# Altium schematic sheet PowerSupplies.SchDoc: Switching Power Supplies
size 594 x 420 mm; CheckedBy: T.Janicki; Author: Grzegorz Kasprowicz; CompanyName: Creotech Instruments SA; DrawnBy: G.Kasprowicz; Organization: CERN; Address1: European Organization for Nuclear Research; Address2: CH-1211 Genève 23 - Switzerland; Revision: -; SheetNumber: 4; SheetTotal: 11; EDA_Number: EDA-xxxx; Projet: Simple VME FMC Carrier; ModifiedBy: -; CreateDate: 20/11/2012; CheckedDate: 23/01/2012; DivGrp: BE-CO; Designer: G.Kasprowicz; PageSetup: Record=PageOptions|CenterHorizontal=True|CenterVertical=True|PrintScale=0.68|XCorrection=1.00|YCorrection=1.00|PrintKind=1|BorderSize=5000000|LeftOffset=0|BottomOffset=0|Orientation=2|PaperLength=1000|PaperWidth=1000|Scale=100|PaperSource=15|PrintQuality=600|MediaType=1|DitherType=10|PaperKind=A3|PrintScaleMode=1; ModifiedDate: -
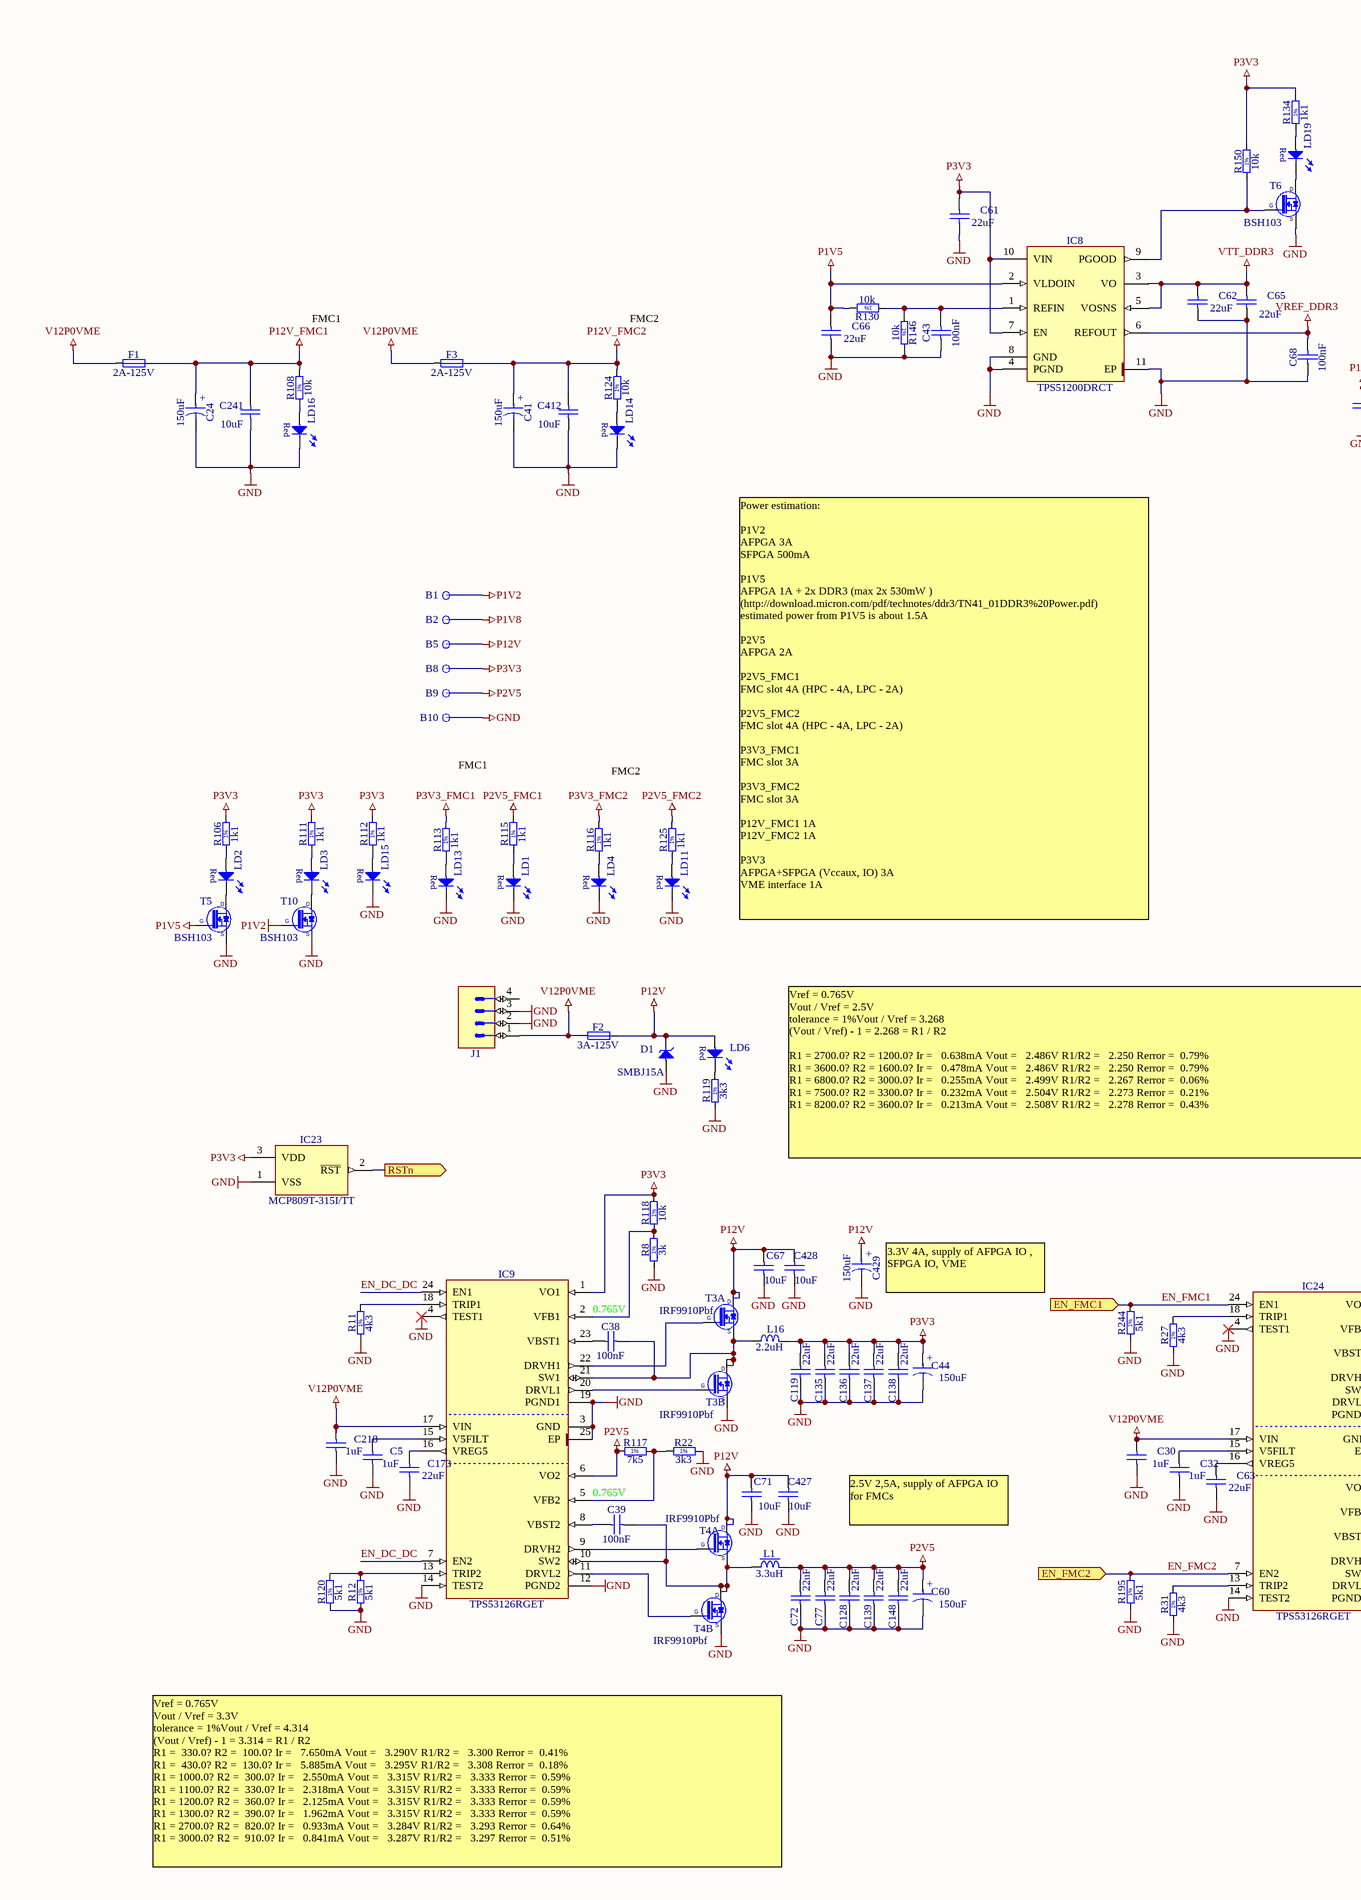
[diagram p0: PowerSupplies.SchDoc, left]
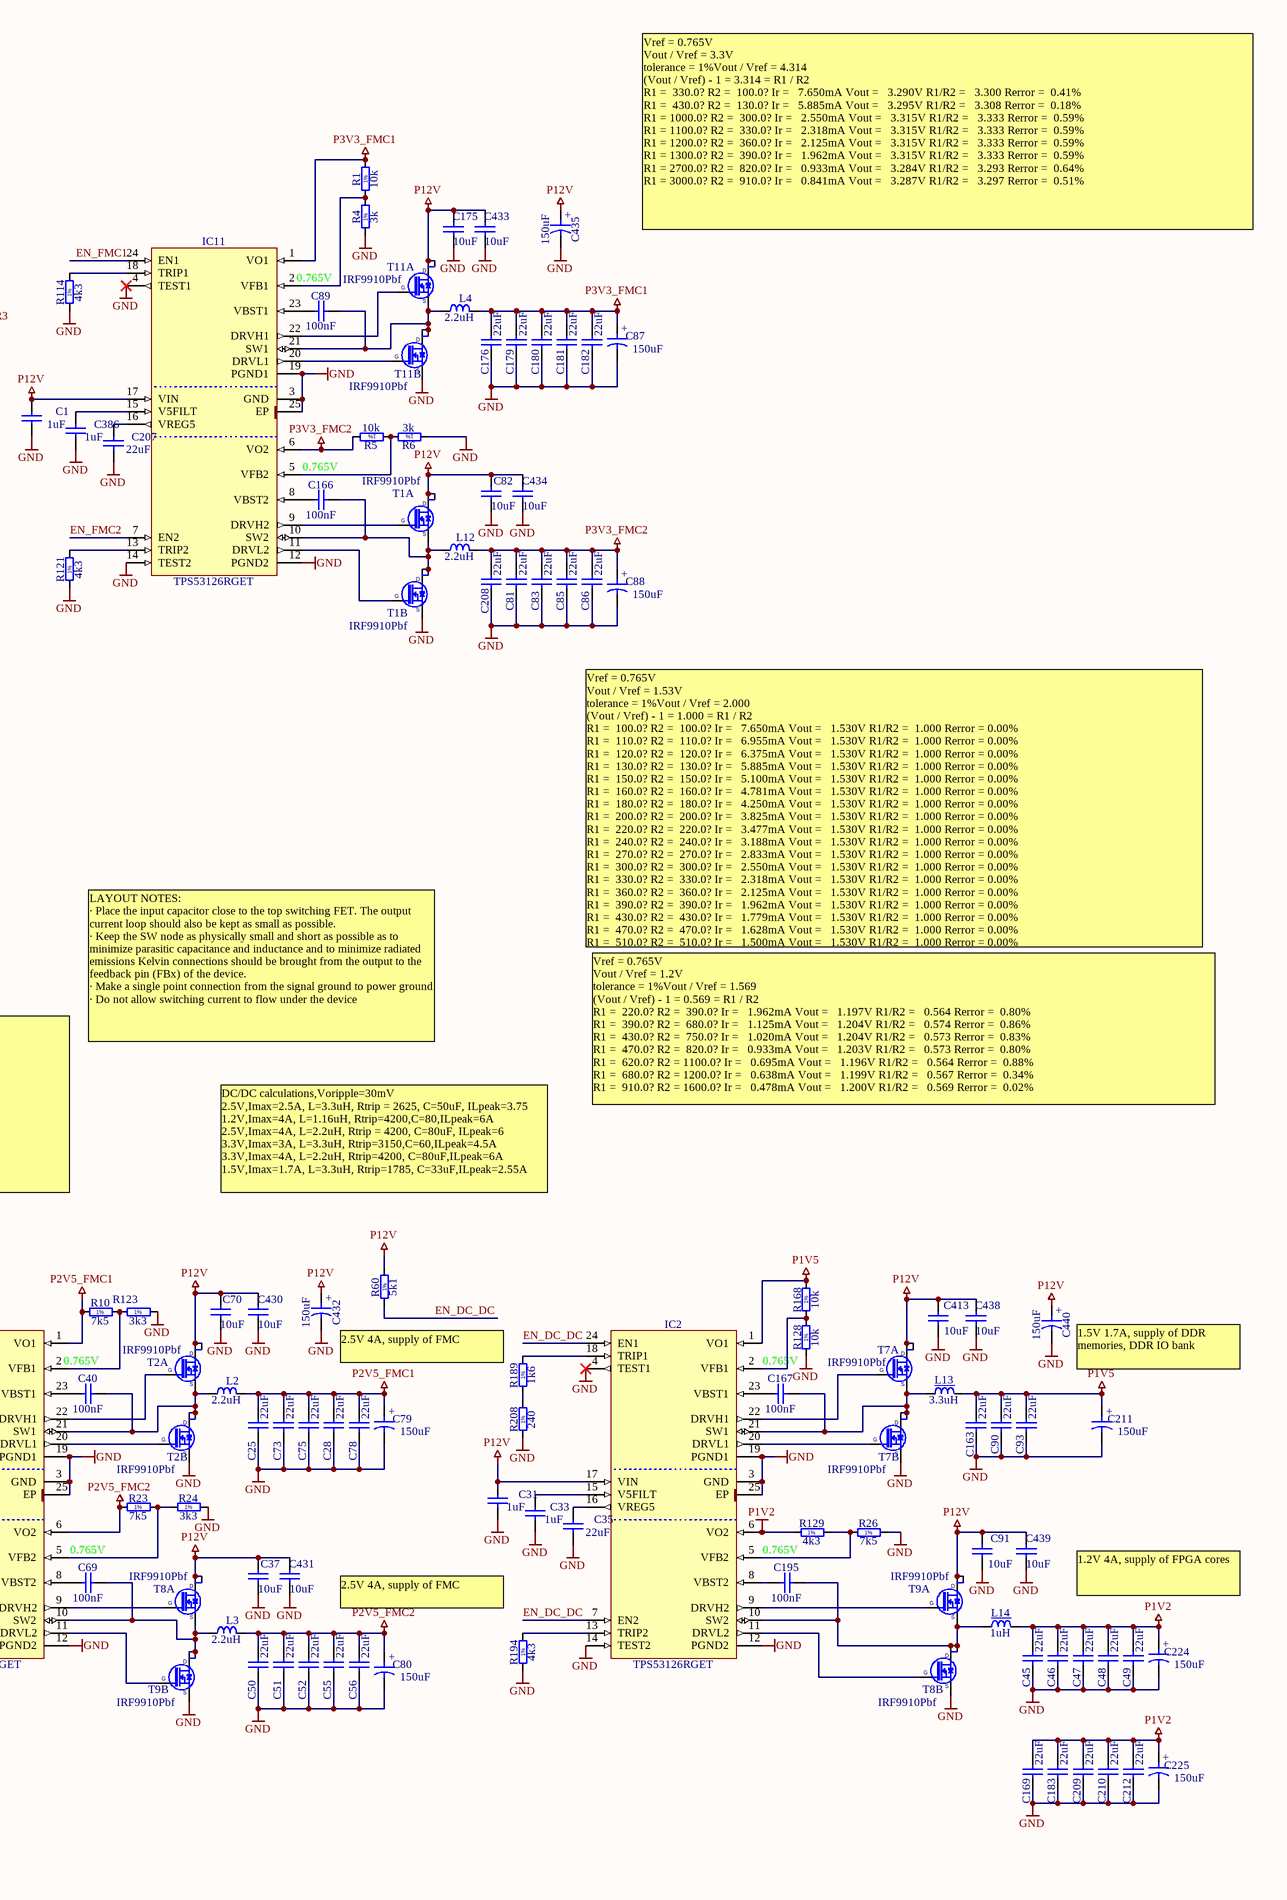
[diagram p1: PowerSupplies.SchDoc, right]

## Parts
B1  Plated Hole  [c130h80]  (value not drawn)
B2  Plated Hole  [c130h80]  (value not drawn)
B5  Plated Hole  [c130h80]  (value not drawn)
B8  Plated Hole  [c130h80]  (value not drawn)
B9  Plated Hole  [c130h80]  (value not drawn)
B10  Plated Hole  [c130h80]  (value not drawn)
C1  1uF  [CAPC1608X87N]
C5  1uF  [CAPC1608X87N]
C24  150uF  [CAPPR350-850X700]
C25  22uF  [CAPC3216X180N]
C28  22uF  [CAPC3216X180N]
C30  1uF  [CAPC1608X87N]
C31  1uF  [CAPC1608X87N]
C32  1uF  [CAPC1608X87N]
C33  1uF  [CAPC1608X87N]
C35  22uF  [CAPC3216X180N]
C37  10uF  [CAPC3225X270N]
C38  100nF  [CAPC1005X55N]
C39  100nF  [CAPC1005X55N]
C40  100nF  [CAPC1005X55N]
C41  150uF  [CAPPR350-850X700]
C43  100nF  [CAPC1005X55N]
C44  150uF  [CAPPR350-850X700]
C45  22uF  [CAPC3216X180N]
C46  22uF  [CAPC3216X180N]
C47  22uF  [CAPC3216X180N]
C48  22uF  [CAPC3216X180N]
C49  22uF  [CAPC3216X180N]
C50  22uF  [CAPC3216X180N]
C51  22uF  [CAPC3216X180N]
C52  22uF  [CAPC3216X180N]
C55  22uF  [CAPC3216X180N]
C56  22uF  [CAPC3216X180N]
C60  150uF  [CAPPR350-850X700]
C61  22uF  [CAPC3216X180N]
C62  22uF  [CAPC3216X180N]
C63  22uF  [CAPC3216X180N]
C65  22uF  [CAPC3216X180N]
C66  22uF  [CAPC3216X180N]
C67  10uF  [CAPC3225X270N]
C68  100nF  [CAPC1005X55N]
C69  100nF  [CAPC1005X55N]
C70  10uF  [CAPC3225X270N]
C71  10uF  [CAPC3225X270N]
C72  22uF  [CAPC3216X180N]
C73  22uF  [CAPC3216X180N]
C75  22uF  [CAPC3216X180N]
C77  22uF  [CAPC3216X180N]
C78  22uF  [CAPC3216X180N]
C79  150uF  [CAPPR350-850X700]
C80  150uF  [CAPPR350-850X700]
C81  22uF  [CAPC3216X180N]
C82  10uF  [CAPC3225X270N]
C83  22uF  [CAPC3216X180N]
C85  22uF  [CAPC3216X180N]
C86  22uF  [CAPC3216X180N]
C87  150uF  [CAPPR350-850X700]
C88  150uF  [CAPPR350-850X700]
C89  100nF  [CAPC1005X55N]
C90  22uF  [CAPC3216X180N]
C91  10uF  [CAPC3225X270N]
C93  22uF  [CAPC3216X180N]
C119  22uF  [CAPC3216X180N]
C128  22uF  [CAPC3216X180N]
C135  22uF  [CAPC3216X180N]
C136  22uF  [CAPC3216X180N]
C137  22uF  [CAPC3216X180N]
C138  22uF  [CAPC3216X180N]
C139  22uF  [CAPC3216X180N]
C148  22uF  [CAPC3216X180N]
C163  22uF  [CAPC3216X180N]
C166  100nF  [CAPC1005X55N]
C167  100nF  [CAPC1005X55N]
C169  22uF  [CAPC3216X180N]
C173  22uF  [CAPC3216X180N]
C175  10uF  [CAPC3225X270N]
C176  22uF  [CAPC3216X180N]
C179  22uF  [CAPC3216X180N]
C180  22uF  [CAPC3216X180N]
C181  22uF  [CAPC3216X180N]
C182  22uF  [CAPC3216X180N]
C183  22uF  [CAPC3216X180N]
C195  100nF  [CAPC1005X55N]
C207  22uF  [CAPC3216X180N]
C208  22uF  [CAPC3216X180N]
C209  22uF  [CAPC3216X180N]
C210  22uF  [CAPC3216X180N]
C211  150uF  [CAPPR350-850X700]
C212  22uF  [CAPC3216X180N]
C218  1uF  [CAPC1608X87N]
C224  150uF  [CAPPR350-850X700]
C225  150uF  [CAPPR350-850X700]
C241  10uF  [CAPC3225X270N]
C386  1uF  [CAPC1608X87N]
C412  10uF  [CAPC3225X270N]
C413  10uF  [CAPC3225X270N]
C427  10uF  [CAPC3225X270N]
C428  10uF  [CAPC3225X270N]
C429  150uF  [CAPPR500-1050X800]
C430  10uF  [CAPC3225X270N]
C431  10uF  [CAPC3225X270N]
C432  150uF  [CAPPR500-1050X800]
C433  10uF  [CAPC3225X270N]
C434  10uF  [CAPC3225X270N]
C435  150uF  [CAPPR500-1050X800]
C438  10uF  [CAPC3225X270N]
C439  10uF  [CAPC3225X270N]
C440  150uF  [CAPPR500-1050X800]
D1  SMBJ15A  [DIOM5336X265N]
F1  2A-125V  [FUSE_LITTELFUSE_0154]
F2  3A-125V  [FUSE_LITTELFUSE_0154]
F3  2A-125V  [FUSE_LITTELFUSE_0154]
IC2  TPS53126RGET  [QFN50P400X400X100-25N-S255]
IC8  TPS51200DRCT  [SON50P300X300X100-11N-R175X250]
IC9  TPS53126RGET  [QFN50P400X400X100-25N-S255]
IC11  TPS53126RGET  [QFN50P400X400X100-25N-S255]
IC23  MCP809T-315I/TT  [SOT95P237X112-3N]
IC24  TPS53126RGET  [QFN50P400X400X100-25N-S255]
J1  Header 4  [TYCO_350211-1]  (value not drawn)
L1  3.3uH  [IND_COILCRAFT_DO3316]
L2  2.2uH  [IND_BOURNS_SRR1260]
L3  2.2uH  [IND_BOURNS_SRR1260]
L4  2.2uH  [IND_BOURNS_SRR1260]
L12  2.2uH  [IND_BOURNS_SRR1260]
L13  3.3uH  [IND_COILCRAFT_DO3316]
L14  1uH  [IND_COILCRAFT_DO3316]
L16  2.2uH  [IND_BOURNS_SRR1260]
LD1  Red  [LEDC1608X80N_RED]  (value not drawn)
LD2  Red  [LEDC1608X80N_RED]  (value not drawn)
LD3  Red  [LEDC1608X80N_RED]  (value not drawn)
LD4  Red  [LEDC1608X80N_RED]  (value not drawn)
LD6  Red  [LEDC1608X80N_RED]  (value not drawn)
LD11  Red  [LEDC1608X80N_RED]  (value not drawn)
LD13  Red  [LEDC1608X80N_RED]  (value not drawn)
LD14  Red  [LEDC1608X80N_RED]  (value not drawn)
LD15  Red  [LEDC1608X80N_RED]  (value not drawn)
LD16  Red  [LEDC1608X80N_RED]  (value not drawn)
LD19  Red  [LEDC1608X80N_RED]  (value not drawn)
R1  10k  [RESC1608X55N]
R4  3k  [RESC1608X55N]
R5  10k  [RESC1608X55N]
R6  3k  [RESC1608X55N]
R8  3k  [RESC1608X55N]
R10  7k5  [RESC1608X55N]
R11  4k3  [RESC1608X55N]
R12  5k1  [RESC1608X55N]
R22  3k3  [RESC1608X55N]
R23  7k5  [RESC1608X55N]
R24  3k3  [RESC1608X55N]
R26  7k5  [RESC1608X55N]
R27  4k3  [RESC1608X55N]
R31  4k3  [RESC1608X55N]
R60  5k1  [RESC1608X55N]
R106  1k1  [RESC1608X55N]
R108  10k  [RESC1608X55N]
R111  1k1  [RESC1608X55N]
R112  1k1  [RESC1608X55N]
R113  1k1  [RESC1608X55N]
R114  4k3  [RESC1608X55N]
R115  1k1  [RESC1608X55N]
R116  1k1  [RESC1608X55N]
R117  7k5  [RESC1608X55N]
R118  10k  [RESC1608X55N]
R119  3k3  [RESC1608X55N]
R120  5k1  [RESC1608X55N]
R121  4k3  [RESC1608X55N]
R123  3k3  [RESC1608X55N]
R124  10k  [RESC1608X55N]
R125  1k1  [RESC1608X55N]
R128  10k  [RESC1608X55N]
R129  4k3  [RESC1608X55N]
R130  10k  [RESC1608X55N]
R134  1k1  [RESC1608X55N]
R146  10k  [RESC1608X55N]
R150  10k  [RESC1608X55N]
R168  10k  [RESC1608X55N]
R189  1k6  [RESC1608X55N]
R194  4k3  [RESC1608X55N]
R195  5k1  [RESC1608X55N]
R208  240  [RESC1608X55N]
R244  5k1  [RESC1608X55N]
T1  IRF9910Pbf  [SOIC127P600X175-8N]  (parts A,B of 2)
T2  IRF9910Pbf  [SOIC127P600X175-8N]  (parts A,B of 2)
T3  IRF9910Pbf  [SOIC127P600X175-8N]  (parts A,B of 2)
T4  IRF9910Pbf  [SOIC127P600X175-8N]  (parts A,B of 2)
T5  BSH103  [SOT95P230X110-3N]
T6  BSH103  [SOT95P230X110-3N]
T7  IRF9910Pbf  [SOIC127P600X175-8N]  (parts A,B of 2)
T8  IRF9910Pbf  [SOIC127P600X175-8N]  (parts A,B of 2)
T9  IRF9910Pbf  [SOIC127P600X175-8N]  (parts A,B of 2)
T10  BSH103  [SOT95P230X110-3N]
T11  IRF9910Pbf  [SOIC127P600X175-8N]  (parts A,B of 2)

## Ports
EN_FMC1 (in), EN_FMC2 (in), RSTn (out)

## Nets
GND: B10.1 C1.2 C5.1 C24.2 C25.1 C28.1 C30.2 C31.1 C32.1 C33.1 C35.1 C37.2 C41.2 C43.1 C44.2 C45.1 C46.1 C47.1 C48.1 C49.1 C50.1 C51.1 C52.1 C55.1 C56.1 C60.2 C61.1 C62.1 C63.1 C65.1 C66.1 C67.2 C68.1 C70.2 C71.2 C72.1 C73.1 C75.1 C77.1 C78.1 C79.2 C80.2 C81.1 C82.2 C83.1 C85.1 C86.1 C87.2 C88.2 C90.1 C91.2 C93.1 C119.1 C128.1 C135.1 C136.1 C137.1 C138.1 C139.1 C148.1 C163.1 C169.1 C173.1 C175.2 C176.1 C179.1 C180.1 C181.1 C182.1 C183.1 C207.1 C208.1 C209.1 C210.1 C211.2 C212.1 C218.1 C224.2 C225.2 C241.2 C386.1 C412.2 C413.2 C427.2 C428.2 C429.2 C430.2 C431.2 C432.2 C433.2 C434.2 C435.2 C438.2 C439.2 C440.2 D1.2(A) IC2.3(GND) IC2.4(TEST1) IC2.12(PGND2) IC2.14(TEST2) IC2.19(PGND1) IC2.25(EP) IC8.4(PGND) IC8.8(GND) IC8.11(EP) IC9.3(GND) IC9.4(TEST1) IC9.12(PGND2) IC9.14(TEST2) IC9.19(PGND1) IC9.25(EP) IC11.3(GND) IC11.4(TEST1) IC11.12(PGND2) IC11.14(TEST2) IC11.19(PGND1) IC11.25(EP) IC23.1(VSS) IC24.3(GND) IC24.4(TEST1) IC24.12(PGND2) IC24.14(TEST2) IC24.19(PGND1) IC24.25(EP) J1.2 J1.3 LD1.1(C) LD4.1(C) LD11.1(C) LD13.1(C) LD14.1(C) LD15.1(C) LD16.1(C) R4.1 R6.1 R8.1 R11.1 R12.1 R22.2 R24.2 R26.2 R27.1 R31.1 R114.1 R119.1 R120.1 R121.1 R123.2 R128.1 R146.2 R194.1 R195.1 R208.1 R244.1 T1.1(S) T2.1(S) T3.1(S) T4.1(S) T5.2(S) T6.2(S) T7.1(S) T8.1(S) T9.1(S) T10.2(S) T11.1(S)
P1V2: B1.1 C45.2 C46.2 C47.2 C48.2 C49.2 C169.2 C183.2 C209.2 C210.2 C212.2 C224.1 C225.1 IC2.6(VO2) L14.2 R129.1 T10.1(G)
P1V5: C66.2 C90.2 C93.2 C163.2 C211.1 IC2.1(VO1) IC8.2(VLDOIN) L13.2 R130.2 R168.2 T5.1(G)
P1V8: B2.1
P2V5: B9.1 C60.1 C72.2 C77.2 C128.2 C139.2 C148.2 IC9.6(VO2) L1.2 R117.1
P2V5_FMC1: C25.2 C28.2 C73.2 C75.2 C78.2 C79.1 IC24.1(VO1) L2.2 R10.1 R115.2
P2V5_FMC2: C50.2 C51.2 C52.2 C55.2 C56.2 C80.1 IC24.6(VO2) L3.2 R23.1 R125.2
P3V3: B8.1 C44.1 C61.2 C119.2 C135.2 C136.2 C137.2 C138.2 IC8.7(EN) IC8.10(VIN) IC9.1(VO1) IC23.3(VDD) L16.2 R106.2 R111.2 R112.2 R118.2 R134.2 R150.2
P3V3_FMC1: C87.1 C176.2 C179.2 C180.2 C181.2 C182.2 IC11.1(VO1) L4.2 R1.2 R113.2
P3V3_FMC2: C81.2 C83.2 C85.2 C86.2 C88.1 C208.2 IC11.6(VO2) L12.2 R5.2 R116.2
P12V: B5.1 C1.1 C31.2 C37.1 C67.1 C70.1 C71.1 C82.1 C91.1 C175.1 C413.1 C427.1 C428.1 C429.1 C430.1 C431.1 C432.1 C433.1 C434.1 C435.1 C438.1 C439.1 C440.1 D1.1(C) F2.2 IC2.17(VIN) IC11.17(VIN) LD6.2(A) R60.2 T1.5(D) T1.6(D) T2.5(D) T2.6(D) T3.5(D) T3.6(D) T4.5(D) T4.6(D) T7.5(D) T7.6(D) T8.5(D) T8.6(D) T9.5(D) T9.6(D) T11.5(D) T11.6(D)
P12V_FMC1: C24.1 C241.1 F1.2 R108.2
P12V_FMC2: C41.1 C412.1 F3.2 R124.2
V12P0VME: C30.1 C218.2 F1.1 F2.1 F3.1 IC9.17(VIN) IC24.17(VIN) J1.1
VREF_DDR3: C68.2 IC8.6(REFOUT)
VTT_DDR3: C62.2 C65.2 IC8.3(VO) IC8.5(VOSNS)
EN_DC_DC: IC2.7(EN2) IC2.24(EN1) IC9.7(EN2) IC9.24(EN1) R60.1
EN_FMC1: IC11.24(EN1) IC24.24(EN1) R244.2 ; port EN_FMC1
EN_FMC2: IC11.7(EN2) IC24.7(EN2) R195.2 ; port EN_FMC2
RSTn: IC23.2(~{RST}) ; port RSTn
NetC5_2: C5.2 IC9.15(V5FILT)
NetC32_2: C32.2 IC24.15(V5FILT)
NetC33_2: C33.2 IC2.15(V5FILT)
NetC35_2: C35.2 IC2.16(VREG5)
NetC38_1: C38.1 IC9.23(VBST1)
NetC38_2: C38.2 IC9.21(SW1) L16.1 T3.3(S) T3.7(D) T3.8(D)
NetC39_1: C39.1 IC9.8(VBST2)
NetC39_2: C39.2 IC9.10(SW2) L1.1 T4.3(S) T4.7(D) T4.8(D)
NetC40_1: C40.1 IC24.23(VBST1)
NetC40_2: C40.2 IC24.21(SW1) L2.1 T2.3(S) T2.7(D) T2.8(D)
NetC43_2: C43.2 IC8.1(REFIN) R130.1 R146.1
NetC63_2: C63.2 IC24.16(VREG5)
NetC69_1: C69.1 IC24.8(VBST2)
NetC69_2: C69.2 IC24.10(SW2) L3.1 T8.3(S) T9.7(D) T9.8(D)
NetC89_1: C89.1 IC11.23(VBST1)
NetC89_2: C89.2 IC11.21(SW1) L4.1 T11.3(S) T11.7(D) T11.8(D)
NetC166_1: C166.1 IC11.8(VBST2)
NetC166_2: C166.2 IC11.10(SW2) L12.1 T1.3(S) T1.7(D) T1.8(D)
NetC167_1: C167.1 IC2.23(VBST1)
NetC167_2: C167.2 IC2.21(SW1) L13.1 T7.3(S) T7.7(D) T7.8(D)
NetC173_2: C173.2 IC9.16(VREG5)
NetC195_1: C195.1 IC2.8(VBST2)
NetC195_2: C195.2 IC2.10(SW2) L14.1 T8.7(D) T8.8(D) T9.3(S)
NetC207_2: C207.2 IC11.16(VREG5)
NetC386_2: C386.2 IC11.15(V5FILT)
NetIC2_2: IC2.2(VFB1) R128.2 R168.1
NetIC2_5: IC2.5(VFB2) R26.1 R129.2
NetIC2_9: IC2.9(DRVH2) T9.4(G)
NetIC2_11: IC2.11(DRVL2) T8.2(G)
NetIC2_13: IC2.13(TRIP2) R194.2
NetIC2_18: IC2.18(TRIP1) R189.2
NetIC2_20: IC2.20(DRVL1) T7.2(G)
NetIC2_22: IC2.22(DRVH1) T7.4(G)
NetIC8_9: IC8.9(PGOOD) R150.1 T6.1(G)
NetIC9_2: IC9.2(VFB1) R8.2 R118.1
NetIC9_5: IC9.5(VFB2) R22.1 R117.2
NetIC9_9: IC9.9(DRVH2) T4.4(G)
NetIC9_11: IC9.11(DRVL2) T4.2(G)
NetIC9_13: IC9.13(TRIP2) R12.2 R120.2
NetIC9_18: IC9.18(TRIP1) R11.2
NetIC9_20: IC9.20(DRVL1) T3.2(G)
NetIC9_22: IC9.22(DRVH1) T3.4(G)
NetIC11_2: IC11.2(VFB1) R1.1 R4.2
NetIC11_5: IC11.5(VFB2) R5.1 R6.2
NetIC11_9: IC11.9(DRVH2) T1.4(G)
NetIC11_11: IC11.11(DRVL2) T1.2(G)
NetIC11_13: IC11.13(TRIP2) R121.2
NetIC11_18: IC11.18(TRIP1) R114.2
NetIC11_20: IC11.20(DRVL1) T11.2(G)
NetIC11_22: IC11.22(DRVH1) T11.4(G)
NetIC24_2: IC24.2(VFB1) R10.2 R123.1
NetIC24_5: IC24.5(VFB2) R23.2 R24.1
NetIC24_9: IC24.9(DRVH2) T8.4(G)
NetIC24_11: IC24.11(DRVL2) T9.2(G)
NetIC24_13: IC24.13(TRIP2) R31.2
NetIC24_18: IC24.18(TRIP1) R27.2
NetIC24_20: IC24.20(DRVL1) T2.2(G)
NetIC24_22: IC24.22(DRVH1) T2.4(G)
NetLD1_2: LD1.2(A) R115.1
NetLD2_1: LD2.1(C) T5.3(D)
NetLD2_2: LD2.2(A) R106.1
NetLD3_1: LD3.1(C) T10.3(D)
NetLD3_2: LD3.2(A) R111.1
NetLD4_2: LD4.2(A) R116.1
NetLD6_1: LD6.1(C) R119.2
NetLD11_2: LD11.2(A) R125.1
NetLD13_2: LD13.2(A) R113.1
NetLD14_2: LD14.2(A) R124.1
NetLD15_2: LD15.2(A) R112.1
NetLD16_2: LD16.2(A) R108.1
NetLD19_1: LD19.1(C) T6.3(D)
NetLD19_2: LD19.2(A) R134.1
NetR189_1: R189.1 R208.2

Not connected (* = marked no-connect by the designer): J1 4

## Notes on the sheet
- Vref = 0.765V
  Vout / Vref = 3.3V
  tolerance = 1%Vout / Vref = 4.314
  (Vout / Vref) - 1 = 3.314 = R1 / R2
  R1 =  330.0?	R2 =  100.0?	Ir =   7.650mA	Vout =   3.290V	R1/R2 =   3.300	Rerror =  0.41%
  R1 =  430.0?	R2 =  130.0?	Ir =   5.885mA	Vout =   3.295V	R1/R2 =   3.308	Rerror =  0.18%
  R1 = 1000.0?	R2 =  300.0?	Ir =   2.550mA	Vout =   3.315V	R1/R2 =   3.333	Rerror =  0.59%
  R1 = 1100.0?	R2 =  330.0?	Ir =   2.318mA	Vout =   3.315V	R1/R2 =   3.333	Rerror =  0.59%
  R1 = 1200.0?	R2 =  360.0?	Ir =   2.125mA	Vout =   3.315V	R1/R2 =   3.333	Rerror =  0.59%
  R1 = 1300.0?	R2 =  390.0?	Ir =   1.962mA	Vout =   3.315V	R1/R2 =   3.333	Rerror =  0.59%
  R1 = 2700.0?	R2 =  820.0?	Ir =   0.933mA	Vout =   3.284V	R1/R2 =   3.293	Rerror =  0.64%
  R1 = 3000.0?	R2 =  910.0?	Ir =   0.841mA	Vout =   3.287V	R1/R2 =   3.297	Rerror =  0.51%
- 0.765V
- FMC1
- FMC2
- Power estimation:
  P1V2
  AFPGA 3A
  SFPGA 500mA
  P1V5
  AFPGA 1A + 2x DDR3 (max 2x 530mW )
  (http://download.micron.com/pdf/technotes/ddr3/TN41_01DDR3%20Power.pdf)
  estimated power from P1V5 is about 1.5A
  P2V5
  AFPGA 2A
  P2V5_FMC1
  FMC slot 4A (HPC - 4A, LPC - 2A)
  P2V5_FMC2
  FMC slot 4A (HPC - 4A, LPC - 2A)
  P3V3_FMC1
  FMC slot 3A
  P3V3_FMC2
  FMC slot 3A
  P12V_FMC1 1A
  P12V_FMC2 1A
  P3V3
  AFPGA+SFPGA (Vccaux, IO) 3A
  VME interface 1A
- Vref = 0.765V
  Vout / Vref = 1.53V
  tolerance = 1%Vout / Vref = 2.000
  (Vout / Vref) - 1 = 1.000 = R1 / R2
  R1 =  100.0?	R2 =  100.0?	Ir =   7.650mA	Vout =   1.530V	R1/R2 =  1.000	Rerror = 0.00%
  R1 =  110.0?	R2 =  110.0?	Ir =   6.955mA	Vout =   1.530V	R1/R2 =  1.000	Rerror = 0.00%
  R1 =  120.0?	R2 =  120.0?	Ir =   6.375mA	Vout =   1.530V	R1/R2 =  1.000	Rerror = 0.00%
  R1 =  130.0?	R2 =  130.0?	Ir =   5.885mA	Vout =   1.530V	R1/R2 =  1.000	Rerror = 0.00%
  R1 =  150.0?	R2 =  150.0?	Ir =   5.100mA	Vout =   1.530V	R1/R2 =  1.000	Rerror = 0.00%
  R1 =  160.0?	R2 =  160.0?	Ir =   4.781mA	Vout =   1.530V	R1/R2 =  1.000	Rerror = 0.00%
  R1 =  180.0?	R2 =  180.0?	Ir =   4.250mA	Vout =   1.530V	R1/R2 =  1.000	Rerror = 0.00%
  R1 =  200.0?	R2 =  200.0?	Ir =   3.825mA	Vout =   1.530V	R1/R2 =  1.000	Rerror = 0.00%
  R1 =  220.0?	R2 =  220.0?	Ir =   3.477mA	Vout =   1.530V	R1/R2 =  1.000	Rerror = 0.00%
  R1 =  240.0?	R2 =  240.0?	Ir =   3.188mA	Vout =   1.530V	R1/R2 =  1.000	Rerror = 0.00%
  R1 =  270.0?	R2 =  270.0?	Ir =   2.833mA	Vout =   1.530V	R1/R2 =  1.000	Rerror = 0.00%
  R1 =  300.0?	R2 =  300.0?	Ir =   2.550mA	Vout =   1.530V	R1/R2 =  1.000	Rerror = 0.00%
  R1 =  330.0?	R2 =  330.0?	Ir =   2.318mA	Vout =   1.530V	R1/R2 =  1.000	Rerror = 0.00%
  R1 =  360.0?	R2 =  360.0?	Ir =   2.125mA	Vout =   1.530V	R1/R2 =  1.000	Rerror = 0.00%
  R1 =  390.0?	R2 =  390.0?	Ir =   1.962mA	Vout =   1.530V	R1/R2 =  1.000	Rerror = 0.00%
  R1 =  430.0?	R2 =  430.0?	Ir =   1.779mA	Vout =   1.530V	R1/R2 =  1.000	Rerror = 0.00%
  R1 =  470.0?	R2 =  470.0?	Ir =   1.628mA	Vout =   1.530V	R1/R2 =  1.000	Rerror = 0.00%
  R1 =  510.0?	R2 =  510.0?	Ir =   1.500mA	Vout =   1.530V	R1/R2 =  1.000	Rerror = 0.00%
- LAYOUT NOTES:
  · Place the input capacitor close to the top switching FET. The output current loop should also be kept as small as possible.
  · Keep the SW node as physically small and short as possible as to minimize parasitic capacitance and inductance and to minimize radiated emissions Kelvin connections should be brought from the output to the feedback pin (FBx) of the device.
  · Make a single point connection from the signal ground to power ground
  · Do not allow switching current to flow under the device
- Vref = 0.765V
  Vout / Vref = 1.2V
  tolerance = 1%Vout / Vref = 1.569
  (Vout / Vref) - 1 = 0.569 = R1 / R2
  R1 =  220.0?	R2 =  390.0?	Ir =   1.962mA	Vout =   1.197V	R1/R2 =   0.564	Rerror =  0.80%
  R1 =  390.0?	R2 =  680.0?	Ir =   1.125mA	Vout =   1.204V	R1/R2 =   0.574	Rerror =  0.86%
  R1 =  430.0?	R2 =  750.0?	Ir =   1.020mA	Vout =   1.204V	R1/R2 =   0.573	Rerror =  0.83%
  R1 =  470.0?	R2 =  820.0?	Ir =   0.933mA	Vout =   1.203V	R1/R2 =   0.573	Rerror =  0.80%
  R1 =  620.0?	R2 = 1100.0?	Ir =   0.695mA	Vout =   1.196V	R1/R2 =   0.564	Rerror =  0.88%
  R1 =  680.0?	R2 = 1200.0?	Ir =   0.638mA	Vout =   1.199V	R1/R2 =   0.567	Rerror =  0.34%
  R1 =  910.0?	R2 = 1600.0?	Ir =   0.478mA	Vout =   1.200V	R1/R2 =   0.569	Rerror =  0.02%
- Vref = 0.765V
  Vout / Vref = 2.5V
  tolerance = 1%Vout / Vref = 3.268
  (Vout / Vref) - 1 = 2.268 = R1 / R2
  R1 = 2700.0?	R2 = 1200.0?	Ir =   0.638mA	Vout =   2.486V	R1/R2 =   2.250	Rerror =  0.79%
  R1 = 3600.0?	R2 = 1600.0?	Ir =   0.478mA	Vout =   2.486V	R1/R2 =   2.250	Rerror =  0.79%
  R1 = 6800.0?	R2 = 3000.0?	Ir =   0.255mA	Vout =   2.499V	R1/R2 =   2.267	Rerror =  0.06%
  R1 = 7500.0?	R2 = 3300.0?	Ir =   0.232mA	Vout =   2.504V	R1/R2 =   2.273	Rerror =  0.21%
  R1 = 8200.0?	R2 = 3600.0?	Ir =   0.213mA	Vout =   2.508V	R1/R2 =   2.278	Rerror =  0.43%
- DC/DC calculations,Voripple=30mV
  2.5V,Imax=2.5A, L=3.3uH, Rtrip = 2625, C=50uF, ILpeak=3.75
  1.2V,Imax=4A, L=1.16uH, Rtrip=4200,C=80,ILpeak=6A
  2.5V,Imax=4A, L=2.2uH, Rtrip = 4200, C=80uF, ILpeak=6
  3.3V,Imax=3A, L=3.3uH, Rtrip=3150,C=60,ILpeak=4.5A
  3.3V,Imax=4A, L=2.2uH, Rtrip=4200, C=80uF,ILpeak=6A
  1.5V,Imax=1.7A, L=3.3uH, Rtrip=1785, C=33uF,ILpeak=2.55A
- (near C429) 3.3V 4A, supply of AFPGA IO , SFPGA IO, VME
- 2.5V 4A, supply of FMC
- (near R128) 0.765V
- (near C440) 1.5V 1.7A, supply of DDR memories, DDR IO bank
- 2.5V 2,5A, supply of AFPGA IO for FMCs
- (near R129) 0.765V
- 1.2V 4A, supply of FPGA cores
- Project/Equipment
- Document
- File
- Designer
- Drawn by
- Check.by
- Last Mod.
- Print Date
- Sheet
- Size
- A2
- of
- Rev
- (in symbol CAER_150UF_6.3V_20%_SANYO_6SEQP150M) +
- (in symbol CAER_150UF_16V_20%_SANYO_16SEQP150M) +
- (in symbol R0603_1K1_1%_0.1W_100PPM) 1%
- (in symbol R0603_1K6_1%_0.1W_100PPM) 1%
- (in symbol R0603_3K3_1%_0.1W_100PPM) 1%
- (in symbol R0603_3K_1%_0.1W_100PPM) 1%
- (in symbol R0603_4K3_1%_0.1W_100PPM) 1%
- (in symbol R0603_5K1_1%_0.1W_100PPM) 1%
- (in symbol R0603_7K5_1%_0.1W_100PPM) 1%
- (in symbol R0603_10K_1%_0.1W_100PPM) 1%
- (in symbol R0603_240R_1%_0.1W_100PPM) 1%

## Library data of the parts
B1 B2 B5 B8-B10 = PLATED_HOLE0.8_PAD1.3: Single Terminal Socket; Part Description: Plated Through Hole: Hole Dia.=0.8mm Pad Dia.=1.3mm; Mounted: No; Table: Pads; Part Number: PLATED_HOLE0.8_PAD1.3; Component Kind: Standard (No BOM); Component Type: Standard (No BOM); Pin Count: 1; Family: Plated Hole; Socket: No; SMD: No; Status: None; ComponentHeight: 0mm; Author: CERN DEM JLC; CreateDate: 2008-10-30; LatestRevisionDate: 2008-10-30; PackageDescription: Plated Through Hole: Hole Dia.=0.8mm Pad Dia.=1.3mm
C1 C5 C30-C33 C218 C386 = CC0603_1UF_16V_10%_X7R: Non-polarised capacitor; Part Description: SMD Multilayer Chip Ceramic Capacitor; Manufacturer: GENERIC; Manufacturer1 Part Number: 223824613663; Voltage: 16V; TC: X7R; Tolerance: ±10%; Table: Capacitors SMD; Part Number: CC0603_1UF_16V_10%_X7R; Component Kind: Standard; Component Type: Standard; Pin Count: 2; Value: 1uF; Status: Preferred; Manufacturer Part Number: CC0603_1uF_16V_10%_X7R; Case: 0603; Mounted: Yes; Socket: No; SMD: Yes; Manufacturer1 Example: PHYCOMP; Manufacturer1 ComponentHeight: 0.87mm; HelpURL: \\cern.ch\dfs\Applications\Altium\Datasheets\CC0805_X5R_PHYCOMP_HC.pdf; Author: CERN DEM JLC
  C1 C30 C31 C218: CreateDate: 12/3/2007; LatestRevisionDate: 12/3/2007
  C5 C32 C33 C386: CreateDate: 03/12/2007; LatestRevisionDate: 03/12/2007
C24 C41 C44 C60 C79 C80 C87 C88 C211 C224 C225 = CAER_150UF_6.3V_20%_SANYO_6SEQP150M: Polarised capacitor; Part Description: Aluminium Solid Capacitor With Conductive Polymer (SEQP Serie); Manufacturer: SANYO OS-CON; Voltage: 6.3V; Tolerance: ±20%; Table: Capacitors THD; Part Number: CAER_150UF_6.3V_20%_SANYO_6SEQP150M; Component Kind: Standard; Component Type: Standard; Pin Count: 2; Value: 150uF; Status: Not Recommended; Manufacturer Part Number: 6SEQP150M; Case: LS3.5 D8 x H7; Mounted: Yes; Socket: No; SMD: No; ComponentHeight: 7mm; HelpURL: \\cern.ch\dfs\Applications\Altium\Datasheets\CAER_SANYO_SEQP.pdf; Author: CERN DEM JLC; CreateDate: 2011-03-07; LatestRevisionDate: 2011-03-07
C25 C28 C35 C45-C52 C55 C56 C61-C63 C65 C66 C72 C73 C75 C77 C78 C81 C83 C85 C86 C90 C93 C119 C128 C135-C139 C148 C163 C169 C173 C176 C179-C183 C207-C210 C212 = CC1206_22UF_10V_10%_X7R: Non-polarised capacitor; Part Description: SMD Multilayer Chip Ceramic Capacitor; Manufacturer: GENERIC; Manufacturer1 Part Number: GRM31CR71A226KE15L; Voltage: 10V; TC: X7R; Tolerance: ±10%; Table: Capacitors SMD; Part Number: CC1206_22UF_10V_10%_X7R; Component Kind: Standard; Component Type: Standard; Pin Count: 2; Value: 22uF; Status: Preferred; Manufacturer Part Number: CC1206_22UF_10V_10%_X7R; Case: 1206; Mounted: Yes; Socket: No; SMD: Yes; Manufacturer1 Example: MURATA; Manufacturer1 ComponentHeight: 1.8mm; HelpURL: \\cern.ch\dfs\Applications\Altium\Datasheets\CC1206_X7R_MURATA_GRM-HI-CAP.pdf; Author: CERN DEM JLC; CreateDate: 2010-06-08; LatestRevisionDate: 2010-06-08
C37 C67 C70 C71 C82 C91 C175 C241 C412 C413 C427 C428 C430 C431 C433 C434 C438 C439 = CC1210_10UF_25V_10%_X7R: Non-polarised capacitor; Part Description: SMD Multilayer Chip Ceramic Capacitor; Manufacturer: GENERIC; Manufacturer1 Part Number: C1210C106K3RAC; Voltage: 25V; TC: X7R; Tolerance: ±10%; Table: Capacitors SMD; Part Number: CC1210_10UF_25V_10%_X7R; Component Kind: Standard; Component Type: Standard; Pin Count: 2; Value: 10uF; Status: None; Manufacturer Part Number: CC1210_10UF_25V_10%_X7R; Case: 1210; Mounted: Yes; Socket: No; SMD: Yes; Manufacturer1 Example: KEMET; Manufacturer1 ComponentHeight: 2.7mm; HelpURL: \\cern.ch\dfs\Applications\Altium\Datasheets\CC1210_X7R_KEMET.pdf; Author: CERN DEM JLC; CreateDate: 5/5/2009; LatestRevisionDate: 4/1/2010
C38-C40 C43 C69 C89 C166 C167 C195 = CC0402_100NF_16V_10%_X7R: Non-polarised capacitor; Part Description: SMD Multilayer Chip Ceramic Capacitor; Manufacturer: GENERIC; Manufacturer1 Part Number: 223878715649; Voltage: 16V; TC: X7R; Tolerance: ±10%; Table: Capacitors SMD; Part Number: CC0402_100NF_16V_10%_X7R; Component Kind: Standard; Component Type: Standard; Pin Count: 2; Value: 100nF; Status: Not Recommended; Manufacturer Part Number: CC0402_100NF_16V_10%_X7R; Case: 0402; Mounted: Yes; Socket: No; SMD: Yes; Manufacturer1 Example: PHYCOMP; Manufacturer1 ComponentHeight: 0.55mm; HelpURL: \\cern.ch\dfs\Applications\Altium\Datasheets\CC0402_X7R_PHYCOMP.pdf; Author: CERN DEM JLC
  C38-C40 C69 C89 C166 C167 C195: CreateDate: 2007-12-03; LatestRevisionDate: 2007-12-03
  C43: CreateDate: 12/3/2007; LatestRevisionDate: 12/3/2007
C68 = CC0402_100NF_16V_10%_X7R: Non-polarised capacitor; Part Description: SMD Multilayer Chip Ceramic Capacitor; Manufacturer: GENERIC; Manufacturer1 Part Number: 223878715649; Manufacturer1 Datasheet: \\cern.ch\dfs\Applications\Altium\Datasheets\CC0402_X7R_PHYCOMP.pdf; Voltage: 16V; TC: X7R; Tolerance: ±10%; Table: Capacitors SMD; Part Number: CC0402_100NF_16V_10%_X7R; Component Kind: Standard; Component Type: Standard; Designator: Capacitor - non polarized; Library Reference: Capacitor - non polarized; Pin Count: 2; Value: 100nF; Status: Not Recommended; Manufacturer Part Number: CC0402_100NF_16V_10%_X7R; Case: 0402; Mounted: Yes; Socket: No; SMD: Yes; Manufacturer1 Example: PHYCOMP; Manufacturer1 ComponentHeight: 0.55mm; HelpURL: \\cern.ch\dfs\Applications\Altium\Datasheets\CC0402_X7R_PHYCOMP.pdf; Author: CERN DEM JLC; CreateDate: 12/3/2007; LatestRevisionDate: 12/3/2007
C429 C432 C435 C440 = CAER_150UF_16V_20%_SANYO_16SEQP150M: Polarised capacitor; Part Description: Aluminium Solid Capacitor With Conductive Polymer (SEQP Serie); Manufacturer: SANYO OS-CON; Voltage: 16V; Tolerance: ±20%; Table: Capacitors THD; Part Number: CAER_150UF_16V_20%_SANYO_16SEQP150M; Component Kind: Standard; Component Type: Standard; Pin Count: 2; Value: 150uF; Status: Not Recommended; Manufacturer Part Number: 16SEQP150M; Case: LS5 D10 x H8; Mounted: Yes; Socket: No; SMD: No; ComponentHeight: 8mm; HelpURL: \\cern.ch\dfs\Applications\Altium\Datasheets\CAER_SANYO_SEQP.pdf; Author: CERN DEM JLC; CreateDate: 2011-03-07; LatestRevisionDate: 2011-03-07
D1 = SMBJ15A: Zener Diode; Part Description: Uni-Directional Transient Voltage Suppressor Diode; Manufacturer: FAIRCHILD SEMICONDUCTOR; Voltage: 15V; Power: 600W; Table: Diodes; Part Number: SMBJ15A; Component Kind: Standard; Component Type: Standard; Device: SMBJ15A; PackageDescription: DO-214-AA/SMB Diode, Molded Body; 5.34mm L X 3.625mm W X 2.65mm H, IPC Medium Density; Manufacturer Part Number: SMBJ15A; Pin Count: 2; Case: DO-214AA; Mounted: Yes; Socket: No; SMD: Yes; ComponentHeight: 2.44mm; HelpURL: \\cern.ch\dfs\Applications\Altium\Datasheets\SMBJ.pdf; Author: CERN DEM JLC; CreateDate: 2008-12-08; LatestRevisionDate: 2011-12-19
F1 F3 = FUSE_LITTELFUSE_0154002.DR: Fuse; Part Description: SMF OMNI-BLOK® Very Fast-Acting Fuse and Holder; Table: Fuses; Part Number: FUSE_LITTELFUSE_0154002.DR; Component Kind: Standard; Component Type: Standard; Pin Count: 2; PackageDescription: SMF Fuse and Holder, 2-Leads, Body 9.73x5.03mm; Family: Fuse & Holder; Mounted: Yes; Socket: No; SMD: Yes; Value: 2A-125V; Manufacturer: LITTELFUSE; Manufacturer Part Number: 0154002.DR; ComponentHeight: 3.81mm; HelpURL: \\cern.ch\dfs\Applications\Altium\Datasheets\FUSE_LITTELFUSE_0154.pdf; Author: CERN DEM JMW; CreateDate: 2009-07-30; LatestRevisionDate: 2009-07-30
F2 = FUSE_LITTELFUSE_0154003.DR: Fuse; Part Description: SMF OMNI-BLOK® Very Fast-Acting Fuse and Holder; Table: Fuses; Part Number: FUSE_LITTELFUSE_0154003.DR; Component Kind: Standard; Component Type: Standard; Pin Count: 2; PackageDescription: SMF Fuse and Holder, 2-Leads, Body 9.73x5.03mm; Family: Fuse & Holder; Mounted: Yes; Socket: No; SMD: Yes; Value: 3A-125V; Manufacturer: LITTELFUSE; Manufacturer Part Number: 0154003.DR; ComponentHeight: 3.81mm; HelpURL: \\cern.ch\dfs\Applications\Altium\Datasheets\FUSE_LITTELFUSE_0154.pdf; Author: CERN DEM JMW; CreateDate: 1/8/2009; LatestRevisionDate: 1/8/2009
IC2 IC9 IC11 IC24 = TPS53126RGET: Dual Synchronous Step-Down Controller For Low Voltage Power Rails; Manufacturer: TEXAS INSTRUMENTS; Table: Analog & Interface; Part Number: TPS53126RGET; Component Kind: Standard; Component Type: Standard; Device: TPS53126RGET; PackageDescription: QFN,0.50mm pitch,square;6 pin X 6 pin,4.15mm X 4.15mm X 1.00mm H body (w/thermal tab 2.55 X 2.55mm),  IPC Medium Density; Part Description: Dual Synchronous Step-Down Controller For Low Voltage Power Rails; Manufacturer Part Number: TPS53126RGET; Pin Count: 25; Case: QFN24; Mounted: Yes; Socket: No; SMD: Yes; ComponentHeight: 1.0mm; Author: CERN DEM JLC; HelpURL: \\cern.ch\dfs\Applications\Altium\Datasheets\TPS53126RGET.pdf; CreateDate: 2010-08-26; LatestRevisionDate: 2010-08-26
IC8 = TPS51200DRCT: Sink/Source DDR Termination Regulator; Part Description: 3.3V Sink/Source DDR Termination Regulator; Manufacturer: TEXAS INSTRUMENTS; Table: Regulators; Part Number: TPS51200DRCT; Component Kind: Standard; Component Type: Standard; Device: TPS51200DRCT; PackageDescription: SON, 0.50mm Pitch, 10-pin, 3.00mm W  X 3.00mm L X 1.00mm Height, (w/thermal tab 1.75 X 2.50 mm), IPC Medium Density; Manufacturer Part Number: TPS51200DRCT; Pin Count: 10; Case: SON10; Mounted: Yes; Socket: No; SMD: Yes; ComponentHeight: 1mm; HelpURL: \\cern.ch\dfs\Applications\Altium\Datasheets\TPS51200DRCT.pdf; Author: CERN DEM JLC; CreateDate: 2/3/2010; LatestRevisionDate: 2/3/2010
IC23 = MCP809T-315I/TT: 3.075V Microcontroller Supervisory Circuit With Push-Pull Output; Manufacturer: MICROCHIP TECHNOLOGY; Table: Analog & Interface; Part Number: MCP809T-315I/TT; Component Kind: Standard; Component Type: Standard; Device: MCP809T-315I/TT; PackageDescription: SOT, 0.95mm, pitch; 3 pin,1.30mm W X 2.92mm L X 1.12mm H body, IPC Medium Density; Part Description: 3.075V Microcontroller Supervisory Circuit With Push-Pull Output; Manufacturer Part Number: MCP809T-315I/TT; Pin Count: 3; Case: SOT23; Mounted: Yes; Socket: No; SMD: Yes; ComponentHeight: 1.12mm; Author: CERN DEM JLC; HelpURL: \\cern.ch\dfs\Applications\Altium\Datasheets\MCP809T-315I-TT.pdf; CreateDate: 2011-06-16; LatestRevisionDate: 2011-06-16
J1 = TYCO_350211-1: Connector 4 Male; Part Description: 4 Circuits In-Line - 200" Centerline, Commercial MATE-N-LOK Header; Manufacturer: TYCO ELECTRONICS; Table: TYCO; Part Number: TYCO_350211-1; Component Kind: Standard; Component Type: Standard; Pin Count: 4; Family: Header 4; Mounted: Yes; Socket: No; SMD: No; Status: None; Manufacturer Part Number: 350211-1; ComponentHeight: 10.29mm; HelpURL: \\cern.ch\dfs\Applications\Altium\Datasheets\TYCO_350211-1.pdf; Author: CERN DEM JLC; CreateDate: 2009-11-05; LatestRevisionDate: 2009-11-05
L1 L13 = IND_3.3UH_20%_COILCRAFT_DO3316P-332MLD: Inductor With Magnetic core; Part Description: SMT Power Inductors; Power: 5.4A; Resistance: 0.015R; Tolerance: ±20%; Table: Inductors SMD; Part Number: IND_3.3UH_20%_COILCRAFT_DO3316P-332MLD; Component Kind: Standard; Component Type: Standard; Pin Count: 2; Value: 3.3uH; Status: None; Manufacturer: COILCRAFT; Manufacturer Part Number: DO3316P-332MLD; Mounted: Yes; Socket: No; SMD: Yes; ComponentHeight: 5.21mm; HelpURL: \\cern.ch\dfs\Applications\Altium\Datasheets\IND_COILCRAFT_DO3316P.pdf; Author: CERN DEM JLC; CreateDate: 2008-06-26; LatestRevisionDate: 2010-02-17
L2-L4 L12 L16 = IND_2.2UH_30%_BOURNS_SRR1260: Inductor; Part Description: Shielded SMD Power Inductors; Manufacturer: BOURNS; Manufacturer Part Number: SRR1260-2R2Y; Power: 8.2A; Resistance: 0.0105R; Tolerance: ±30%; Table: Inductors SMD; Part Number: IND_2.2UH_30%_BOURNS_SRR1260; Component Kind: Standard; Component Type: Standard; Pin Count: 2; Value: 2.2uH; Status: None; Mounted: Yes; Socket: No; SMD: Yes; ComponentHeight: 6.5mm; HelpURL: \\cern.ch\dfs\Applications\Altium\Datasheets\IND_BOURNS_SRR1260.pdf; Author: CERN DEM JLC; CreateDate: 2010-08-30; LatestRevisionDate: 2010-08-30
L14 = IND_1UH_20%_COILCRAFT_DO3316P-102MLD: Inductor With Magnetic core; Part Description: SMT Power Inductors; Power: 6.8A; Resistance: 0.009R; Tolerance: ±20%; Table: Inductors SMD; Part Number: IND_1UH_20%_COILCRAFT_DO3316P-102MLD; Component Kind: Standard; Component Type: Standard; Pin Count: 2; Value: 1uH; Status: None; Manufacturer: COILCRAFT; Manufacturer Part Number: DO3316P-102MLD; Mounted: Yes; Socket: No; SMD: Yes; ComponentHeight: 5.21mm; HelpURL: \\cern.ch\dfs\Applications\Altium\Datasheets\IND_COILCRAFT_DO3316P.pdf; Author: CERN DEM JLC; CreateDate: 2008-06-26; LatestRevisionDate: 2010-02-17
LD1-LD4 LD6 LD11 LD13-LD16 LD19 = LED_ROHM_SML-311UTT86K: LED Red 1C 2A; Part Description: Low current chip LED SML-311 Serie; Manufacturer: ROHM; Table: LEDs & Displays; Part Number: LED_ROHM_SML-311UTT86K; Component Kind: Standard; Component Type: Standard; Color: Red; Manufacturer Part Number: SML-311UTT86K; Pin Count: 2; Mounted: Yes; Socket: No; SMD: Yes; ComponentHeight: 0.8mm; HelpURL: \\cern.ch\dfs\Applications\Altium\Datasheets\LED_ROHM_SML-311UTT86K.pdf; Author: CERN DEM JLC; CreateDate: 3/16/2010; LatestRevisionDate: 3/17/2010
  LD1-LD4 LD11 LD13-LD16 LD19: PackageDescription: Chip RED LED, 2-Leads, Body 1.6x0.8mm, IPC Medium Density
  LD6: PackageDescription: Chip Red LED, 2-Leads, Body 1.6x0.8mm, IPC Medium Density
R1 R5 R108 R118 R124 R128 R130 R146 R150 R168 = R0603_10K_1%_0.1W_100PPM: Resistor - 1%; Part Description: General Purpose Thick Film Chip Resistor; Manufacturer: GENERIC; Manufacturer1 Part Number: NRC06F1002TRF; Power: 0.1W; TC: ±100ppm/°C; Table: Resistors SMD; Part Number: R0603_10K_1%_0.1W_100PPM; Component Kind: Standard; Component Type: Standard; Pin Count: 2; Value: 10k; Status: Preferred; Tolerance: ±1%; Manufacturer Part Number: R0603_10K_1%_0.1W_100PPM; Case: 0603; Mounted: Yes; Socket: No; SMD: Yes; Manufacturer1 Example: NIC COMPONENT; Manufacturer1 ComponentHeight: 0.55mm; HelpURL: \\cern.ch\dfs\Applications\Altium\Datasheets\R0603_NIC_NRC.pdf; Author: CERN DEM JLC
  R1 R5 R108 R118 R124 R130 R146 R150: CreateDate: 2007-12-03; LatestRevisionDate: 2008-03-13
  R128 R168: CreateDate: 12/3/2007; LatestRevisionDate: 3/13/2008
R4 R6 R8 = R0603_3K_1%_0.1W_100PPM: Resistor - 1%; Part Description: General Purpose Thick Film Chip Resistor; Manufacturer: GENERIC; Manufacturer1 Part Number: NRC06F3001TRF; Power: 0.1W; TC: ±100ppm/°C; Table: Resistors SMD; Part Number: R0603_3K_1%_0.1W_100PPM; Component Kind: Standard; Component Type: Standard; Pin Count: 2; Value: 3k; Status: Preferred; Tolerance: ±1%; Manufacturer Part Number: R0603_3K_1%_0.1W_100PPM; Case: 0603; Mounted: Yes; Socket: No; SMD: Yes; Manufacturer1 Example: NIC COMPONENT; Manufacturer1 ComponentHeight: 0.55mm; HelpURL: \\cern.ch\dfs\Applications\Altium\Datasheets\R0603_NIC_NRC.pdf; Author: CERN DEM JLC; CreateDate: 2007-12-03; LatestRevisionDate: 2008-03-13
R10 R23 R26 R117 = R0603_7K5_1%_0.1W_100PPM: Resistor - 1%; Part Description: General Purpose Thick Film Chip Resistor; Manufacturer: GENERIC; Manufacturer1 Part Number: NRC06F7501TRF; Power: 0.1W; TC: ±100ppm/°C; Table: Resistors SMD; Part Number: R0603_7K5_1%_0.1W_100PPM; Component Kind: Standard; Component Type: Standard; Pin Count: 2; Value: 7k5; Status: Preferred; Tolerance: ±1%; Manufacturer Part Number: R0603_7K5_1%_0.1W_100PPM; Case: 0603; Mounted: Yes; Socket: No; SMD: Yes; Manufacturer1 Example: NIC COMPONENT; Manufacturer1 ComponentHeight: 0.55mm; HelpURL: \\cern.ch\dfs\Applications\Altium\Datasheets\R0603_NIC_NRC.pdf; Author: CERN DEM JLC; CreateDate: 2007-12-03; LatestRevisionDate: 2008-03-13
R11 R27 R31 R114 R121 R129 R194 = R0603_4K3_1%_0.1W_100PPM: Resistor - 1%; Part Description: General Purpose Thick Film Chip Resistor; Manufacturer: GENERIC; Manufacturer1 Part Number: NRC06F4301TRF; Power: 0.1W; TC: ±100ppm/°C; Table: Resistors SMD; Part Number: R0603_4K3_1%_0.1W_100PPM; Component Kind: Standard; Component Type: Standard; Pin Count: 2; Value: 4k3; Status: Preferred; Tolerance: ±1%; Manufacturer Part Number: R0603_4K3_1%_0.1W_100PPM; Case: 0603; Mounted: Yes; Socket: No; SMD: Yes; Manufacturer1 Example: NIC COMPONENT; Manufacturer1 ComponentHeight: 0.55mm; HelpURL: \\cern.ch\dfs\Applications\Altium\Datasheets\R0603_NIC_NRC.pdf; Author: CERN DEM JLC; CreateDate: 2007-12-03; LatestRevisionDate: 2008-03-13
R12 R60 R120 R195 R244 = R0603_5K1_1%_0.1W_100PPM: Resistor - 1%; Part Description: General Purpose Thick Film Chip Resistor; Manufacturer: GENERIC; Manufacturer1 Part Number: NRC06F5101TRF; Power: 0.1W; TC: ±100ppm/°C; Table: Resistors SMD; Part Number: R0603_5K1_1%_0.1W_100PPM; Component Kind: Standard; Component Type: Standard; Pin Count: 2; Value: 5k1; Status: Preferred; Tolerance: ±1%; Manufacturer Part Number: R0603_5K1_1%_0.1W_100PPM; Case: 0603; Mounted: Yes; Socket: No; SMD: Yes; Manufacturer1 Example: NIC COMPONENT; Manufacturer1 ComponentHeight: 0.55mm; HelpURL: \\cern.ch\dfs\Applications\Altium\Datasheets\R0603_NIC_NRC.pdf; Author: CERN DEM JLC; CreateDate: 12/3/2007; LatestRevisionDate: 3/13/2008
R22 R24 R119 R123 = R0603_3K3_1%_0.1W_100PPM: Resistor - 1%; Part Description: General Purpose Thick Film Chip Resistor; Manufacturer: GENERIC; Manufacturer1 Part Number: NRC06F3301TRF; Power: 0.1W; TC: ±100ppm/°C; Table: Resistors SMD; Part Number: R0603_3K3_1%_0.1W_100PPM; Component Kind: Standard; Component Type: Standard; Pin Count: 2; Value: 3k3; Status: Preferred; Tolerance: ±1%; Manufacturer Part Number: R0603_3K3_1%_0.1W_100PPM; Case: 0603; Mounted: Yes; Socket: No; SMD: Yes; Manufacturer1 Example: NIC COMPONENT; Manufacturer1 ComponentHeight: 0.55mm; HelpURL: \\cern.ch\dfs\Applications\Altium\Datasheets\R0603_NIC_NRC.pdf; Author: CERN DEM JLC
  R22 R24 R123: CreateDate: 2007-12-03; LatestRevisionDate: 2008-03-13
  R119: CreateDate: 12/3/2007; LatestRevisionDate: 3/13/2008
R106 R111-R113 R115 R116 R125 R134 = R0603_1K1_1%_0.1W_100PPM: Resistor - 1%; Part Description: General Purpose Thick Film Chip Resistor; Manufacturer: GENERIC; Manufacturer1 Part Number: NRC06F1101TRF; Power: 0.1W; TC: ±100ppm/°C; Table: Resistors SMD; Part Number: R0603_1K1_1%_0.1W_100PPM; Component Kind: Standard; Component Type: Standard; Pin Count: 2; Value: 1k1; Status: Preferred; Tolerance: ±1%; Manufacturer Part Number: R0603_1K1_1%_0.1W_100PPM; Case: 0603; Mounted: Yes; Socket: No; SMD: Yes; Manufacturer1 Example: NIC COMPONENT; Manufacturer1 ComponentHeight: 0.55mm; HelpURL: \\cern.ch\dfs\Applications\Altium\Datasheets\R0603_NIC_NRC.pdf; Author: CERN DEM JLC; CreateDate: 2007-12-03; LatestRevisionDate: 2008-03-13
R189 = R0603_1K6_1%_0.1W_100PPM: Resistor - 1%; Part Description: General Purpose Thick Film Chip Resistor; Manufacturer: GENERIC; Manufacturer1 Part Number: NRC06F1601TRF; Power: 0.1W; TC: ±100ppm/°C; Table: Resistors SMD; Part Number: R0603_1K6_1%_0.1W_100PPM; Component Kind: Standard; Component Type: Standard; Pin Count: 2; Value: 1k6; Status: Preferred; Tolerance: ±1%; Manufacturer Part Number: R0603_1K6_1%_0.1W_100PPM; Case: 0603; Mounted: Yes; Socket: No; SMD: Yes; Manufacturer1 Example: NIC COMPONENT; Manufacturer1 ComponentHeight: 0.55mm; HelpURL: \\cern.ch\dfs\Applications\Altium\Datasheets\R0603_NIC_NRC.pdf; Author: CERN DEM JLC; CreateDate: 2007-12-03; LatestRevisionDate: 2008-03-13
R208 = R0603_240R_1%_0.1W_100PPM: Resistor - 1%; Part Description: General Purpose Thick Film Chip Resistor; Manufacturer: GENERIC; Manufacturer1 Part Number: NRC06F2400TRF; Power: 0.1W; TC: ±100ppm/°C; Table: Resistors SMD; Part Number: R0603_240R_1%_0.1W_100PPM; Component Kind: Standard; Component Type: Standard; Pin Count: 2; Value: 240; Status: Preferred; Tolerance: ±1%; Manufacturer Part Number: R0603_240R_1%_0.1W_100PPM; Case: 0603; Mounted: Yes; Socket: No; SMD: Yes; Manufacturer1 Example: NIC COMPONENT; Manufacturer1 ComponentHeight: 0.55mm; HelpURL: \\cern.ch\dfs\Applications\Altium\Datasheets\R0603_NIC_NRC.pdf; Author: CERN DEM JLC; CreateDate: 12/3/2007; LatestRevisionDate: 3/13/2008
T1-T4 T7-T9 T11 = IRF9910Pbf: Dual SO-8 MOSFET For POL Cconverter; Part Description: 20V 10A(Q1) 20V 12A (Q2) Dual SO-8 MOSFET For POL Cconverter; Manufacturer: INTERNATIONAL RECTIFIER; Table: Transistors; Part Number: IRF9910Pbf; Component Kind: Standard; Component Type: Standard; Device: IRF9910Pbf; PackageDescription: SOIC 8, Pitch 1.27mm - Body 4x5mm, IPC Medium Density; Manufacturer Part Number: IRF9910Pbf; Pin Count: 8; Case: DO8; Mounted: Yes; Socket: No; SMD: Yes; ComponentHeight: 1.75mm; HelpURL: \\cern.ch\dfs\Applications\Altium\Datasheets\IRF9910Pbf.pdf; Author: CERN DEM JLC; CreateDate: 2010-08-30; LatestRevisionDate: 2010-08-30
T5 T6 T10 = BSH103: N-CHANNEL MOSFET WITH DIODE; Part Description: 50V 200mA N-Channel Enhancement Mode Field-Effect Transistor; Manufacturer: NXP SEMICONDUCTORS; Table: Transistors; Part Number: BSH103; Component Kind: Standard; Component Type: Standard; Device: BSH103; PackageDescription: SOT23, 3 pin, Pitch 0.95mm - 1.3mm W X 2.9mm L X 1.1mm H, IPC Medium Density; Manufacturer Part Number: BSH103; Pin Count: 3; Case: SOT23-3; Mounted: Yes; Socket: No; SMD: Yes; ComponentHeight: 1.1mm; HelpURL: \\cern.ch\dfs\Applications\Altium\Datasheets\BSH103.pdf; Author: CERN DEM JLC; CreateDate: 3/16/2010; LatestRevisionDate: 3/16/2010